# EAGLE design led-pwm4 (EAGLE 5.12)
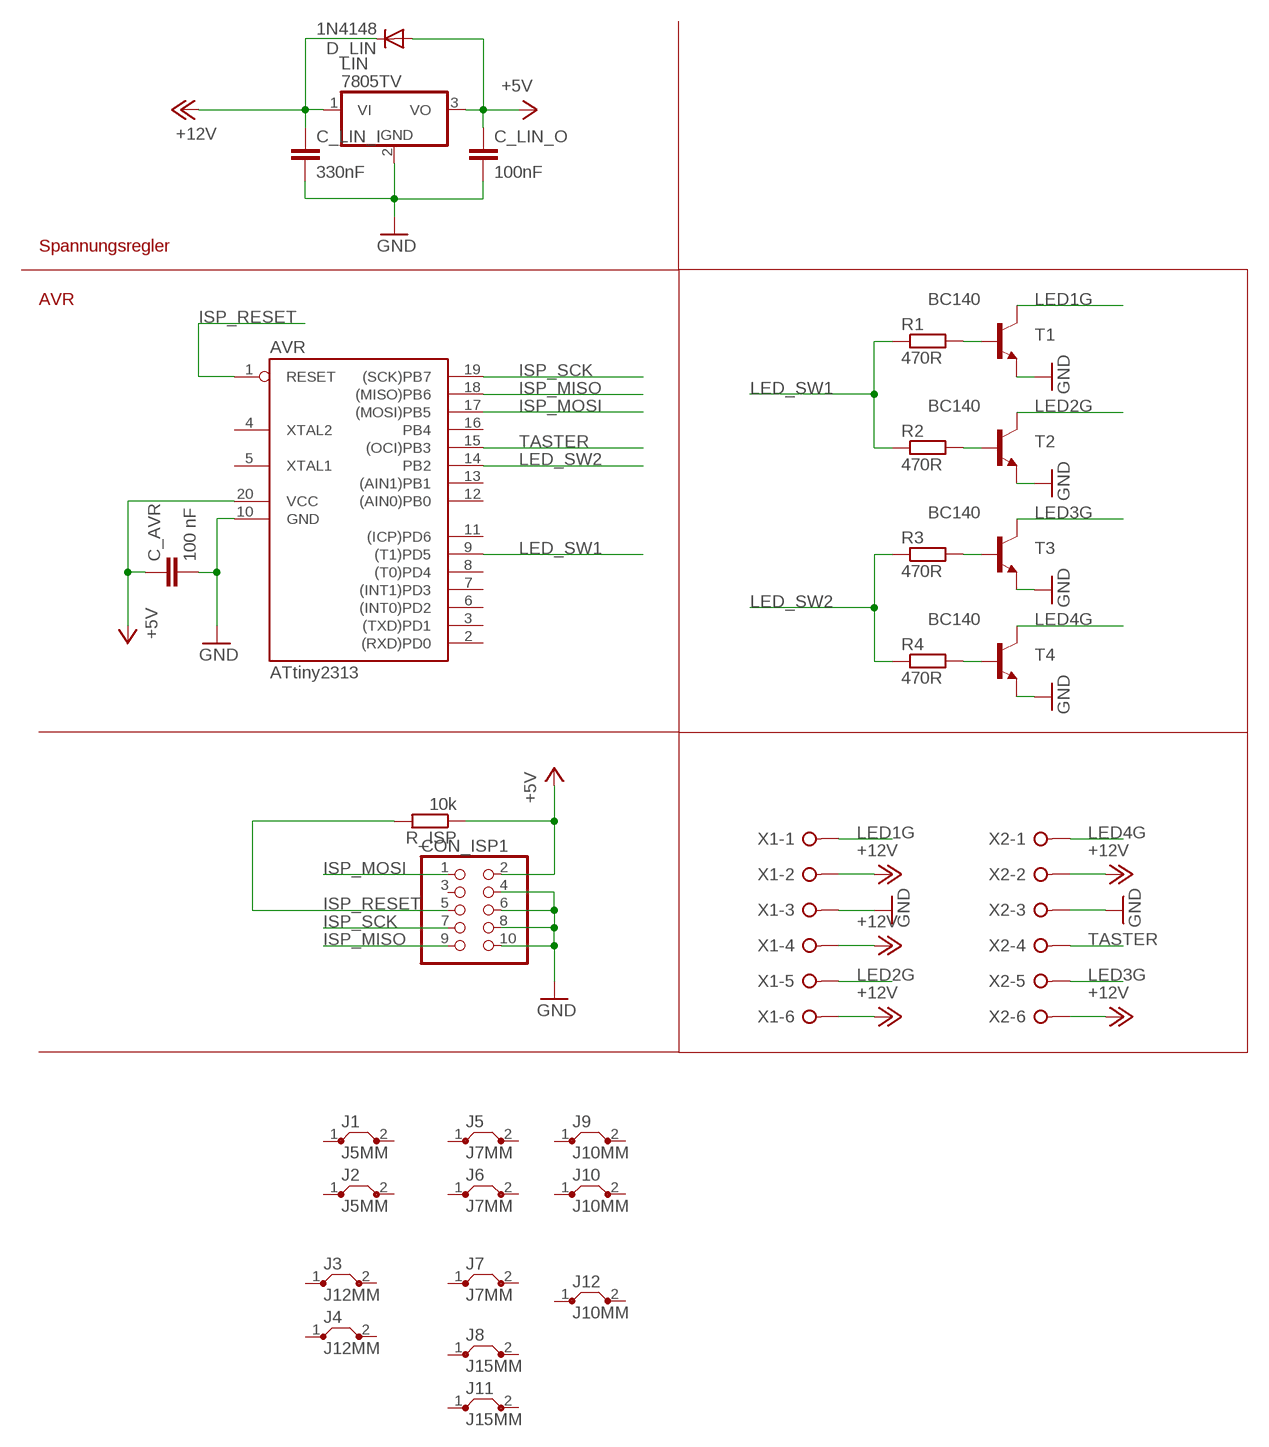
[diagram p0: schematic, sheet 1]

## Parts
AVR  ATtiny2313  AT90S2313P  [DIL20]
C_AVR  100 nF  C-EUC0805K  [C0805K]
C_LIN_I  330nF  C-EU050-025X075  [C050-025X075]
C_LIN_O  100nF  C-EU025-025X050  [C025-025X050]
CON_ISP1  PINHD-2X5  [2X05]
D_LIN  1N4148  1N4148DO35-7  [DO35-7]
J1  J5MM  [05]
J2  J5MM  [05]
J3  J12MM  [12]
J4  J12MM  [12]
J5  J7MM  [07]
J6  J7MM  [07]
J7  J7MM  [07]
J8  J15MM  [15]
J9  J10MM  [10]
J10  J10MM  [10]
J11  J15MM  [15]
J12  J10MM  [10]
LIN  7805TV  [TO220V]
R1  470R  R-EU_0207/10  [0207/10]
R2  470R  R-EU_0207/10  [0207/10]
R3  470R  R-EU_0207/10  [0207/10]
R4  470R  R-EU_0207/10  [0207/10]
R_ISP  10k  R-EU_0207/10  [0207/10]
T1  BC140  BC140-10-NPN-TO39-EBC  [TO39]
T2  BC140  BC140-10-NPN-TO39-EBC  [TO39]
T3  BC140  BC140-10-NPN-TO39-EBC  [TO39]
T4  BC140  BC140-10-NPN-TO39-EBC  [TO39]
X1  W237-06P  [W237-6P]
X2  W237-06P  [W237-6P]

## Nets
+5V: AVR.20(VCC) C_AVR.1 C_LIN_O.1 CON_ISP1.2 D_LIN.A LIN.3(VO) R_ISP.1
+12V: C_LIN_I.1 D_LIN.C LIN.1(VI) X1.2 X1.4 X1.6 X2.2 X2.6
GND: AVR.10(GND) C_AVR.2 C_LIN_I.2 C_LIN_O.2 CON_ISP1.4 CON_ISP1.6 CON_ISP1.8 CON_ISP1.10 LIN.2(GND) T1.1(E) T2.1(E) T3.1(E) T4.1(E) X1.3 X2.3
ISP_MISO: AVR.18((MISO)PB6) CON_ISP1.9
ISP_MOSI: AVR.17((MOSI)PB5) CON_ISP1.1
ISP_RESET: AVR.1(RESET) CON_ISP1.5 R_ISP.2
ISP_SCK: AVR.19((SCK)PB7) CON_ISP1.7
LED1G: T1.3(C) X1.1
LED2G: T2.3(C) X1.5
LED3G: T3.3(C) X2.5
LED4G: T4.3(C) X2.1
LED_SW1: AVR.9((T1)PD5) R1.1 R2.1
LED_SW2: AVR.14(PB2) R3.1 R4.1
N$4: R1.2 T1.2(B)
N$5: R2.2 T2.2(B)
N$6: R3.2 T3.2(B)
N$8: R4.2 T4.2(B)
TASTER: AVR.15((OCI)PB3) X2.4
Unconnected: AVR.2((RXD)PD0) AVR.3((TXD)PD1) AVR.4(XTAL2) AVR.5(XTAL1) AVR.6((INT0)PD2) AVR.7((INT1)PD3) AVR.8((T0)PD4) AVR.11((ICP)PD6) AVR.12((AIN0)PB0) AVR.13((AIN1)PB1) AVR.16(PB4) CON_ISP1.3 J1.1 J1.2 J2.1 J2.2 J3.1 J3.2 J4.1 J4.2 J5.1 J5.2 J6.1 J6.2 J7.1 J7.2 J8.1 J8.2 J9.1 J9.2 J10.1 J10.2 J11.1 J11.2 J12.1 J12.2

## Notes on the sheet
- Spannungsregler
- AVR

## Library data of the parts
AVR = atmel:AT90S2313: MICROCONTROLLER 2 Kbytes FLASH 128 bytes SRAM 128 bytes EEPROM UART; OC_FARNELL: unknown; OC_NEWARK: unknown
C_AVR C_LIN_I C_LIN_O = rcl:C-EU: CAPACITOR, European symbol
CON_ISP1 = pinhead:PINHD-2X5: PIN HEADER
D_LIN = diode:1N4148: DIODE high speed (Philips)
J1-J12 = jumper:J: Bridge
LIN = linear:78*: Positive VOLTAGE REGULATOR Source: http://cache.national.com/ds/LM/LM78L05.pdf http://www.fairchildsemi.com/ds/LM/LM7805.pdf
R1-R4 R_ISP = rcl:R-EU_: RESISTOR, European symbol
T1-T4 = transistor:*-NPN-: NPN Transistror BF959 corrected 2008.03.06
X1 X2 = con-wago-508:W237-06P: WAGO SREW CLAMP; OC_FARNELL: unknown; OC_NEWARK: unknown

## Board
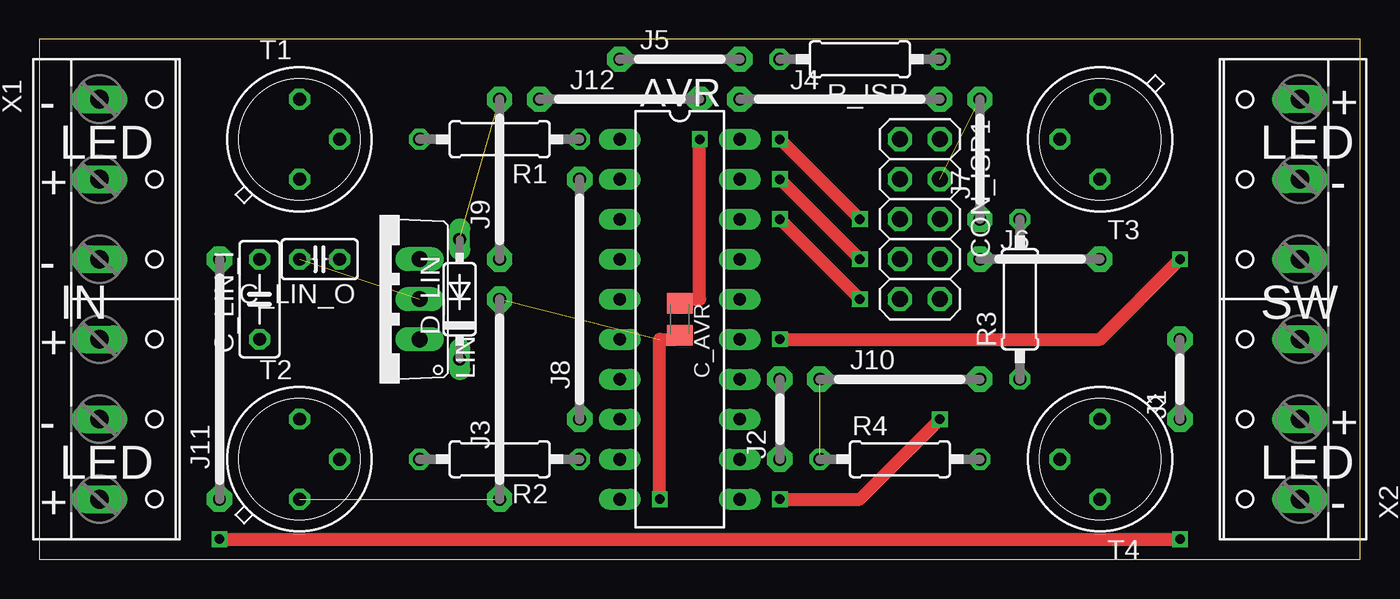
[diagram p1: board, top side]
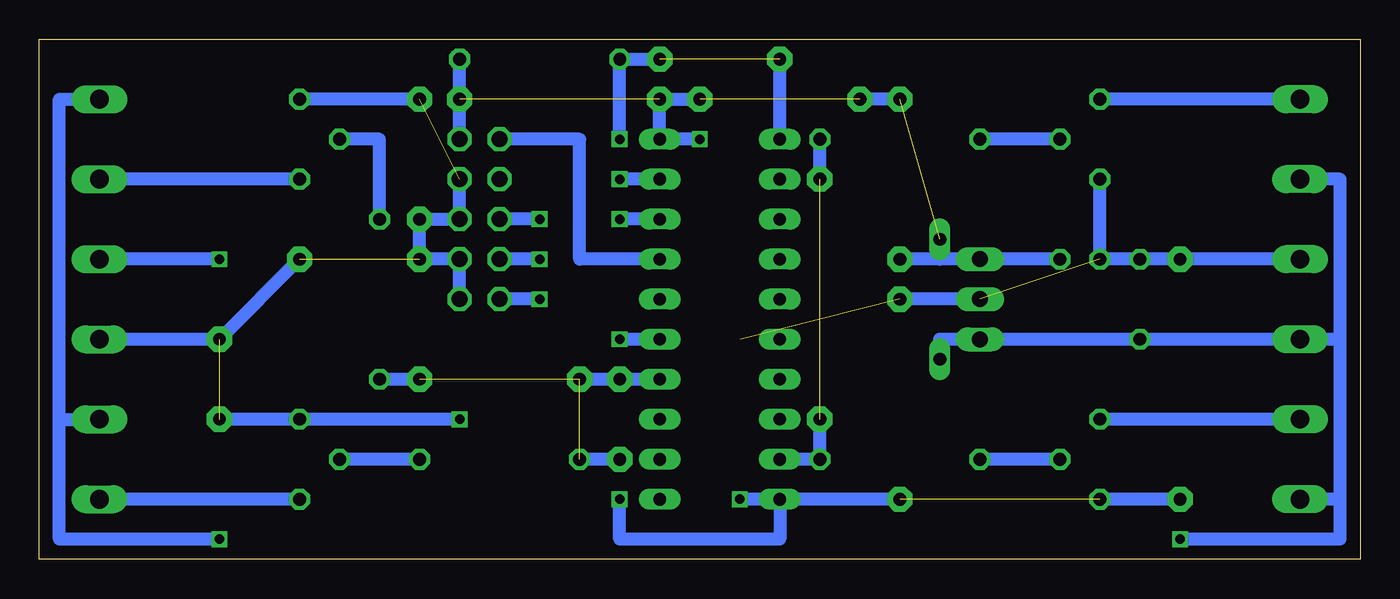
[diagram p2: board, bottom side, seen from below]

Size 83.82 x 33.01 mm. Coordinates in mm from the lower left corner, seen from the top.
Outline: 0,0 83.82,0 83.82,33.01 0,33.01 0,0
Copper layers (1*16): Top 0.035mm / dielectric 1.5mm / Bottom 0.035mm
Design rules "default": minimum track width 10mil, minimum drill 24mil, track to track 8mil, track to pad 8mil, pad to pad 8mil, via to via 8mil, smd to smd 8mil, copper to edge 40mil, drill to drill 8mil, minimum pad ring 10mil, minimum via ring 8mil, stop-mask expansion 4mil, vias tented up to drill 0mil, thermal gap 10mil

### Footprints (pad centres in the part's own frame; a part is rotated, then mirrored left to right if it is on the bottom)
DIL20 = drill 0.813 long: 1 -11.43,-3.81; 2 -8.89,-3.81; 3 -6.35,-3.81; 4 -3.81,-3.81; 5 -1.27,-3.81; 6 1.27,-3.81; 7 3.81,-3.81; 8 6.35,-3.81; 9 8.89,-3.81; 10 11.43,-3.81; 11 11.43,3.81; 12 8.89,3.81; 13 6.35,3.81; 14 3.81,3.81; 15 1.27,3.81; 16 -1.27,3.81; 17 -3.81,3.81; 18 -6.35,3.81; 19 -8.89,3.81; 20 -11.43,3.81
C0805K = smd 1.3 x 1.6: 1 -1,0; 2 1,0
C050-025X075 = drill 0.813 octagon: 1 -2.54,0; 2 2.54,0
C025-025X050 = drill 0.813 octagon: 1 -1.27,0; 2 1.27,0
2X05 = drill 1.016 octagon: 1 -5.08,-1.27; 2 -5.08,1.27; 3 -2.54,-1.27; 4 -2.54,1.27; 5 0,-1.27; 6 0,1.27; 7 2.54,-1.27; 8 2.54,1.27; 9 5.08,-1.27; 10 5.08,1.27
DO35-7 = drill 0.813 long: A 3.81,0; C -3.81,0
05 = drill 0.813 pad 1.6 octagon: 1 -2.54,0; 2 2.54,0
12 = drill 0.813 pad 1.6 octagon: 1 -6.35,0; 2 6.35,0
07 = drill 0.813 pad 1.6 octagon: 1 -3.81,0; 2 3.81,0
15 = drill 0.813 pad 1.6 octagon: 1 -7.62,0; 2 7.62,0
10 = drill 0.813 pad 1.6 octagon: 1 -5.08,0; 2 5.08,0
TO220V = drill 1.016 long: 1 -2.54,-2.54; 2 0,-2.54; 3 2.54,-2.54
0207/10 = drill 0.813 octagon: 1 -5.08,0; 2 5.08,0
TO39 = drill 0.813 octagon: 1 0,-2.54; 2 2.54,0; 3 0,2.54
W237-6P = drill 1.194 long: 1 -12.7,-0.635; 2 -7.62,-0.635; 3 -2.54,-0.635; 4 2.54,-0.635; 5 7.62,-0.635; 6 12.7,-0.635

### Placement (x,y rotation side)
AVR  40.64,15.24 270 top
C_AVR  40.64,15.24 270 top
C_LIN_I  13.97,16.51 90 top
C_LIN_O  17.78,19.05 180 top
CON_ISP1  55.88,21.59 270 top
D_LIN  26.67,16.51 90 top
J1  72.39,11.43 90 top
J2  46.99,8.89 90 top
J3  29.21,10.16 90 top
J4  50.8,29.21 0 top
J5  40.64,31.75 0 top
J6  63.5,19.05 0 top
J7  59.69,25.4 90 top
J8  34.29,16.51 90 top
J9  29.21,24.13 90 top
J10  54.61,11.43 0 top
J11  11.43,11.43 90 top
J12  36.83,29.21 0 top
LIN  21.59,16.51 90 top
R1  29.21,26.67 180 top
R2  29.21,6.35 180 top
R3  62.23,16.51 90 top
R4  54.61,6.35 0 top
R_ISP  52.07,31.75 180 top
T1  16.51,26.67 0 top
T2  16.51,6.35 0 top
T3  67.31,26.67 180 top
T4  67.31,6.35 180 top
X1  4.45,16.51 270 top
X2  79.38,16.51 90 top

### Tracks (layer width: path | path; a pad name or v marks a point on that pad's centre or on a via)
+5V  (via drill 0.6)  (3 unrouted)
  Top 0.813: C_AVR.1 40.91,16.51 41.91,16.51 v41.91,26.67
  Bottom 0.813: C_LIN_O.1 LIN.3 26.67,19.05 | 26.67,19.05 v29.21,19.05 | v29.21,29.21 v31.75,29.21 | 26.67,19.05 D_LIN.A | v41.91,29.21 v44.45,29.21 AVR.20 v41.91,26.67 | CON_ISP1.2 v57.15,29.21 R_ISP.1
  other vias: 57.15,31.75
+12V  (via drill 0.6)
  Top 0.813: v11.43,1.27 v72.39,1.27
  Bottom 0.813: X1.2 1.27,24.13 1.27,13.97 | 1.27,13.97 X1.4 C_LIN_I.1 LIN.1 26.67,13.97 D_LIN.C | 1.27,3.81 1.27,13.97 | 1.27,3.81 X1.6 | v72.39,1.27 82.55,1.27 82.55,8.89 | v11.43,1.27 1.27,1.27 1.27,3.81 | 82.55,8.89 X2.2 | X2.6 82.55,29.21 82.55,8.89
GND  (via drill 0.6)  (6 unrouted)
  Top 0.813: C_AVR.2 40.37,13.97 39.37,13.97 v39.37,3.81 | v46.99,3.81 52.07,3.81 v57.15,8.89
  Bottom 0.813: X1.3 v11.43,19.05 C_LIN_I.2 C_LIN_O.2 T1.1 | v11.43,3.81 T2.1 | LIN.2 v29.21,16.51 | v29.21,3.81 AVR.10 | CON_ISP1.4 CON_ISP1.6 v59.69,21.59 v59.69,19.05 CON_ISP1.8 CON_ISP1.10 | AVR.10 36.83,1.27 46.99,1.27 v46.99,3.81 | AVR.10 v39.37,3.81 | v59.69,29.21 T3.1 | v57.15,8.89 T4.1 v72.39,8.89 | X2.3 v72.39,13.97 v67.31,19.05
ISP_MISO  (via drill 0.6)
  Top 0.813: v46.99,21.59 v52.07,16.51
  Bottom 0.813: v52.07,16.51 CON_ISP1.9 | AVR.18 v46.99,21.59
ISP_MOSI
  Bottom 0.813: AVR.17 49.53,19.05 49.53,26.67 CON_ISP1.1
ISP_RESET  (via drill 0.6)  (1 unrouted)
  Top 0.813: v46.99,26.67 v52.07,21.59
  Bottom 0.813: v52.07,21.59 CON_ISP1.5 | AVR.1 v36.83,31.75 | v46.99,26.67 R_ISP.2 v44.45,31.75
ISP_SCK  (via drill 0.6)
  Top 0.813: v46.99,24.13 v52.07,19.05
  Bottom 0.813: v52.07,19.05 CON_ISP1.7 | AVR.19 v46.99,24.13
LED1G
  Bottom 0.813: X1.1 T1.3
LED2G
  Bottom 0.813: X1.5 T2.3
LED3G
  Bottom 0.813: T3.3 X2.5
LED4G
  Bottom 0.813: T4.3 X2.1
LED_SW1  (via drill 0.6)  (1 unrouted)
  Bottom 0.813: AVR.9 R2.1 v34.29,8.89 | v34.29,24.13 R1.1
LED_SW2  (via drill 0.6)  (2 unrouted)
  Bottom 0.813: v46.99,6.35 R4.1 | v49.53,11.43 v46.99,11.43 AVR.14 | v59.69,11.43 R3.1
N$4
  Bottom 0.813: T1.2 R1.2
N$5
  Bottom 0.813: T2.2 R2.2
N$6
  Bottom 0.813: R3.2 62.23,26.67 T3.2
N$8
  Bottom 0.813: R4.2 T4.2
TASTER  (via drill 0.6)
  Top 0.813: v72.39,19.05 67.31,13.97 v46.99,13.97
  Bottom 0.813: v72.39,19.05 X2.4 | AVR.15 v46.99,13.97

### Text on the board
tNames: - | + | LED | LED | + | - | - | IN | SW | + | - | + | LED | LED | + | -